# EAGLE design Hindi character1 (EAGLE 7.6.0)
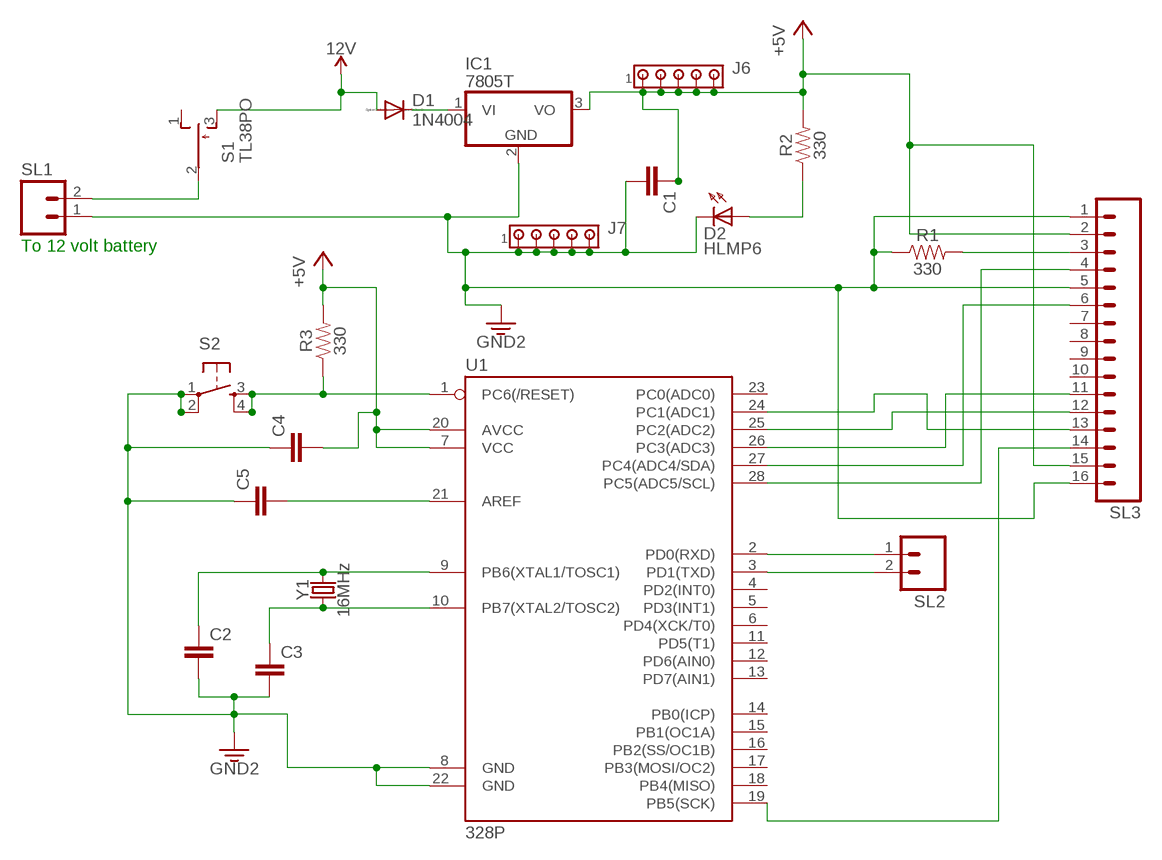
[diagram p0: schematic, sheet 1]

## Parts
C1  C5/2.5  [C5B2.5]
C2  C5/2.5  [C5B2.5]
C3  C5/2.5  [C5B2.5]
C4  C5/2.5  [C5B2.5]
C5  C5/2.5  [C5B2.5]
D1  1N4004  [DO41-10]
D2  HLMP6  [HLMP6]
IC1  7805T  [TO220H]
J6  MTA05-100  [10X05MTA]
J7  MTA05-100  [10X05MTA]
R1  330  330OHM-HORIZ-1/10W-5%  [AXIAL-0.3]
R2  330  330OHM-HORIZ-1/10W-5%  [AXIAL-0.3]
R3  330  330OHM-HORIZ-1/10W-5%  [AXIAL-0.3]
S1  TL38PO  [TL3XPO]
S2  TAC_SWITCHPTH  [TACTILE-PTH]
SL1  MA02  [02PA]
SL2  MA02  [02PA]
SL3  MA16  [16PA]
U1  328P  ATMEGA328P_PDIP  [DIP28]
Y1  16MHz  CRYSTAL-16MHZPTH-HC49US  [HC49US]

## Nets
3.3V: C1.2 C2.2 C3.2 C4.1 C5.1 D2.K IC1.2(GND) J7.1 J7.2 J7.3 J7.4 J7.5 R1.P$1 S2.1 S2.2 SL1.1 SL3.1 SL3.5 SL3.16 U1.8(GND) U1.22(GND) ; supply symbol labelled GND2
12V: D1.A S1.3(S)
+5V: C1.1 C4.2 IC1.3(VO) J6.1 J6.2 J6.3 J6.4 J6.5 R2.P$2 R3.P$2 SL3.2 SL3.15 U1.7(VCC) U1.20(AVCC)
N$1: SL2.1 U1.2(PD0(RXD))
N$2: SL2.2 U1.3(PD1(TXD))
N$3: SL3.4 U1.28(PC5(ADC5/SCL))
N$4: SL3.6 U1.27(PC4(ADC4/SDA))
N$5: R1.P$2 SL3.3
N$6: SL3.11 U1.26(PC3(ADC3))
N$7: D2.A R2.P$1
N$8: C3.1 U1.10(PB7(XTAL2/TOSC2)) Y1.1
N$9: SL3.12 U1.25(PC2(ADC2))
N$10: R3.P$1 S2.3 S2.4 U1.1(PC6(/RESET))
N$11: SL3.13 U1.24(PC1(ADC1))
N$12: C5.2 U1.21(AREF)
N$13: SL3.14 U1.19(PB5(SCK))
N$14: S1.2(P) SL1.2
N$16: D1.C IC1.1(VI)
N$18: C2.1 U1.9(PB6(XTAL1/TOSC1)) Y1.2
Unconnected: S1.1(O) SL3.7 SL3.8 SL3.9 SL3.10 U1.4(PD2(INT0)) U1.5(PD3(INT1)) U1.6(PD4(XCK/T0)) U1.11(PD5(T1)) U1.12(PD6(AIN0)) U1.13(PD7(AIN1)) U1.14(PB0(ICP)) U1.15(PB1(OC1A)) U1.16(PB2(SS/OC1B)) U1.17(PB3(MOSI/OC2)) U1.18(PB4(MISO)) U1.23(PC0(ADC0))

## Notes on the sheet
- To 12 volt battery

## Library data of the parts
C1-C5 = capacitor-wima:C: CAPACITOR naming: grid - package width
D1 = diode:1N4004: DIODE general purpose rectifier, 1 A
D2 = display-hp:HLMP6: LED 2mm horizontal; MF: AGILENT TECHNOLOGIES; MPN: HLMP-6500; OC_FARNELL: 1652490; OC_NEWARK: 40K0088
IC1 = linear:78*: Positive VOLTAGE REGULATOR Source: http://cache.national.com/ds/LM/LM78L05.pdf http://www.fairchildsemi.com/ds/LM/LM7805.pdf
J6 J7 = con-amp:MTA05-100: AMP connector
R1-R3 = SparkFun-Resistors:330OHM: 330Ω resistor A resistor is a passive two-terminal electrical component that implements electrical resistance as a circuit element. Resistors act to reduce current flow, and, at the same time, act to lower voltage levels within circuits. - Wikipedia; PROD_ID: RES-8371
S1 = switch:TL38PO: TINY SWITCH ON OFF MOM Source: http://www2.produktinfo.conrad.com/datenblaetter/700000-724999/705152-da-01-de-Subminiaturschalter_TL_36YO.pdf
S2 = SparkFun-Retired:TAC_SWITCH: Momentary Switch Button commonly used for reset or general input. Spark Fun Electronics SKU : COM-00097 SMT- SWCH-08247
SL1 SL2 = con-amp-quick:MA02: AMP QUICK CONNECTOR; OC_FARNELL: unknown; OC_NEWARK: unknown
SL3 = con-amp-quick:MA16: AMP QUICK CONNECTOR; OC_FARNELL: unknown; OC_NEWARK: unknown
U1 = SparkFun-IC-Microcontroller:ATMEGA328P_PDIP: Atmel 328P Through hole ATMEGA328P uC used in the Arduino 32kb flash, 1k EEPROM, 2k SRAM Datasheet <http://www.sparkfun.com/datasheets/Components/SMD/ATMega328.pdf> SparkFun Products Storefront component: AVR 28 Pin 20MHz 32K 6A/D - ATMega328P <https://www.sparkfun.com/products/9061> (COM-09061) SparkFun Simon Says - Through-Hole Soldering Kit <https://www.sparkfun.com/products/10547> (KIT-10547) SparkFun Learn to Solder - Simon Says <https://www.sparkfun.com/products/13708> (KIT-13708) SparkFun BigTime Watch Kit <https://www.sparkfun.com/products/11734> (KIT-11734) SparkFun ClockIt <https://www.sparkfun.com/products/10930> (KIT-10930) SparkFun Serial Enabled LCD Kit <https://www.sparkfun.com/products/10097> (LCD-10097) SparkFun Simon Tilts - Through Hole Soldering Kit <https://www.sparkfun.com/products/12634> (KIT-12634) SparkFun Frequency Counter Kit <https://www.sparkfun.com/products/10140> (KIT-10140) FabFM Radio Kit <https://www.sparkfun.com/products/11043> (KIT-11043) SparkFun Binary Blaster Kit <https://www.sparkfun.com/products/12037> (KIT-12037) SparkFun Metro-Gnome <https://www.sparkfun.com/products/9236> (KIT-09236) ATmega328 with Arduino Optiboot (Uno) <https://www.sparkfun.com/products/10524> (DEV-10524); PROD_ID: IC-09136
Y1 = SparkFun-Clocks:CRYSTAL-16MHZ: 16MHz Crystal Digikey Example <http://www.digikey.com/product-search/en?keywords=535-9122-1-ND> Frequency: 16MHz Frequency Stability: ±50ppm Frequency Tolerance: ±20ppm Load Capacitance: 18pF SparkFun Products: Pro Micro -5V/16MHz <https://www.sparkfun.com/products/12640> SparkFun Serial Enabled LCD Kit <https://www.sparkfun.com/products/10097>; PROD_ID: XTAL-08181; SF_ID: COM-00536

## Board
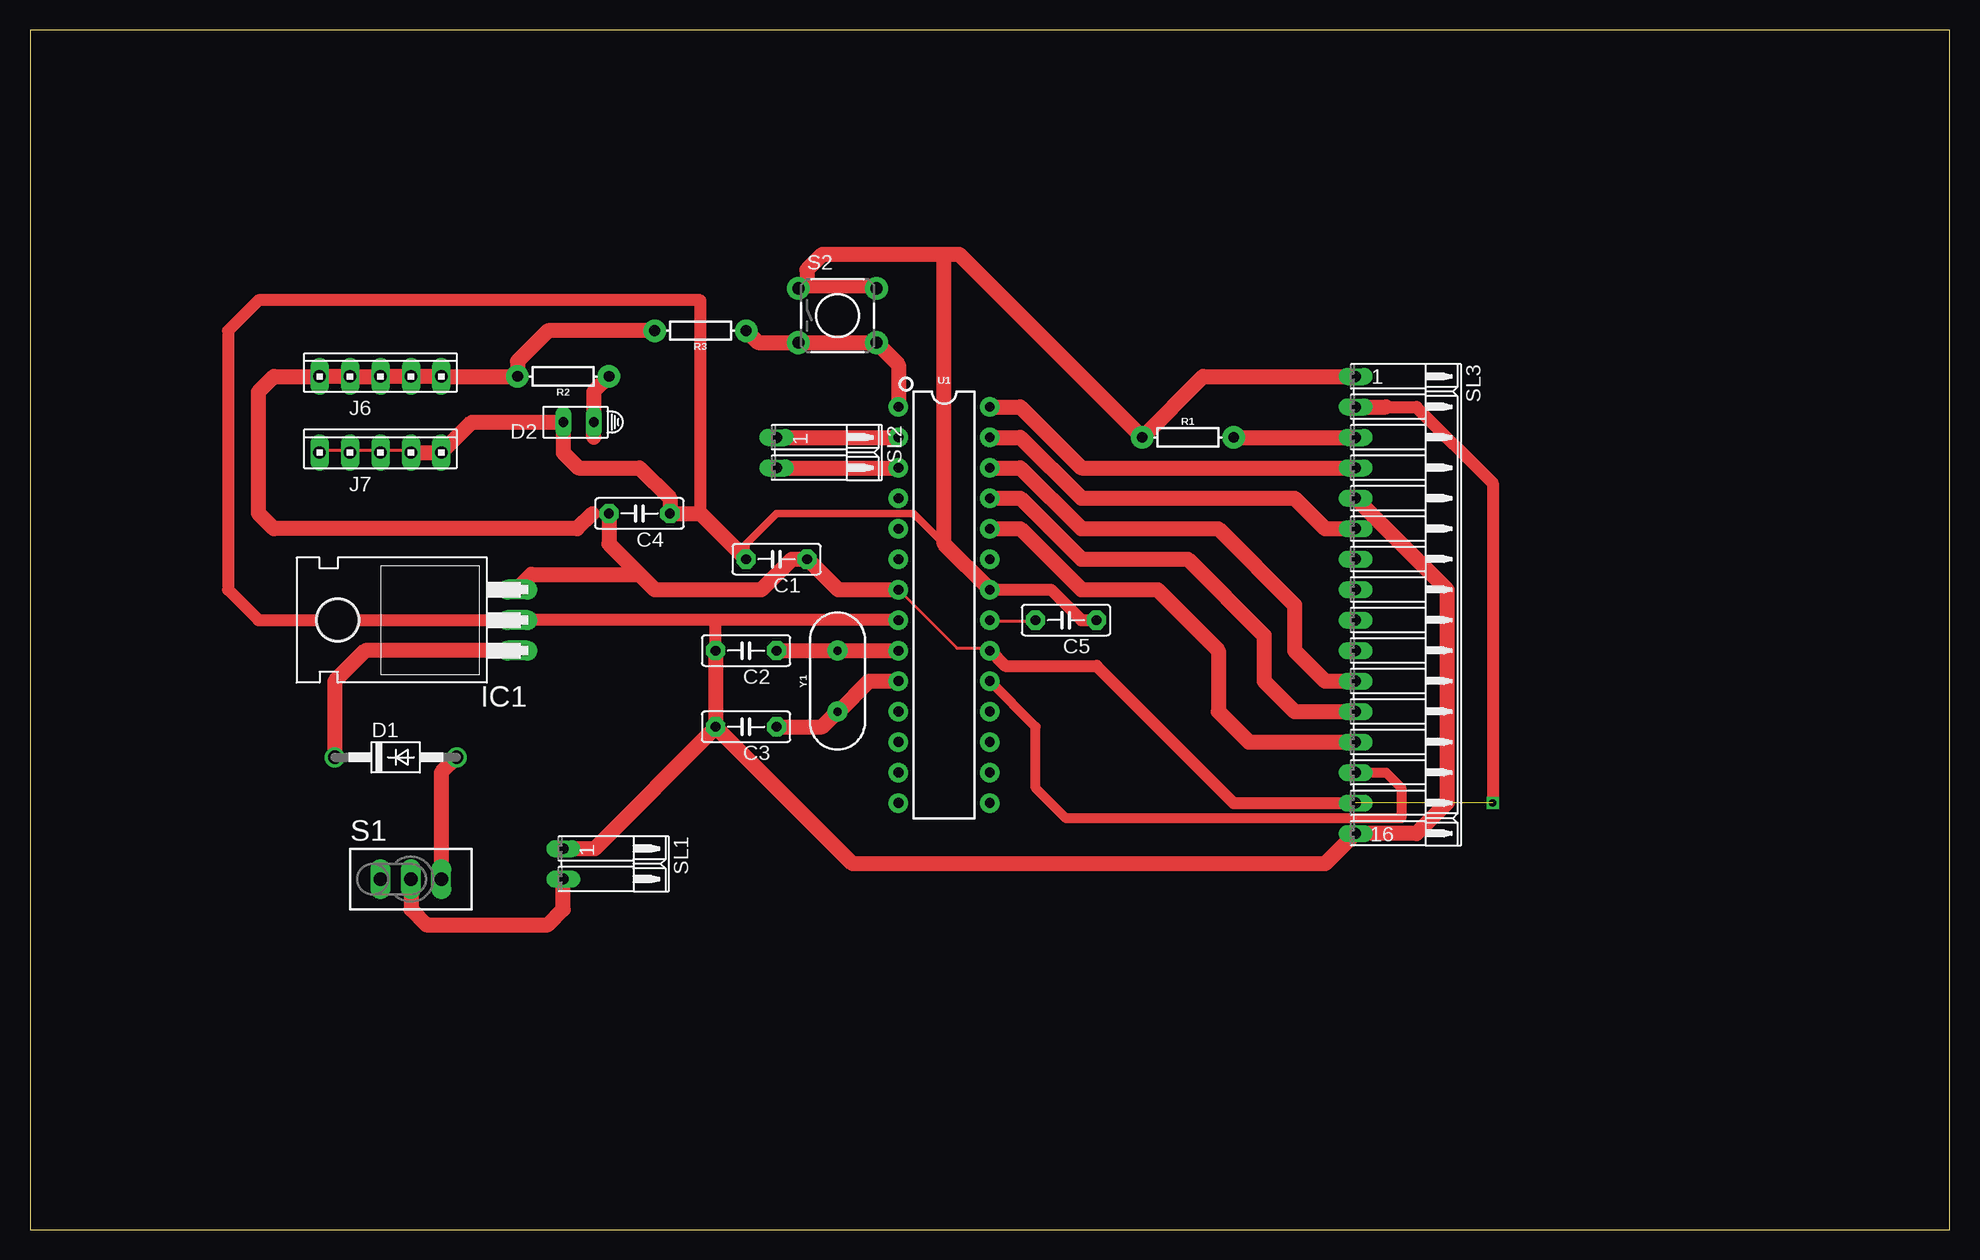
[diagram p1: board, top side]

Size 160 x 100 mm. Coordinates in mm from the lower left corner, seen from the top.
Outline: 0,0 160,0 160,100 0,100 0,0
Copper layers (1*16): Top 0.035mm / dielectric 1.5mm / Bottom 0.035mm
Design rules "default": minimum track width 10mil, minimum drill 24mil, track to track 8mil, track to pad 8mil, pad to pad 8mil, via to via 8mil, smd to smd 8mil, copper to edge 40mil, drill to drill 8mil, minimum pad ring 10mil, minimum via ring 8mil, stop-mask expansion 4mil, vias tented up to drill 0mil, thermal gap 10mil

### Footprints (pad centres in the part's own frame; a part is rotated, then mirrored left to right if it is on the bottom)
C5B2.5 = drill 0.813 pad 1.6 octagon: 1 -2.54,0; 2 2.54,0
DO41-10 = drill 1.118: A 5.08,0; C -5.08,0
HLMP6 = drill 0.813 long: A -1.27,0; K 1.27,0
TO220H = drill 1.118 long: 1 -2.54,-10.16; 2 0,-10.16; 3 2.54,-10.16 | hole 3.302: 0,4.826
10X05MTA = drill 1.016 long: 1 5.08,0; 2 2.54,0; 3 0,0; 4 -2.54,0; 5 -5.08,0
AXIAL-0.3 = drill 0.9 pad 1.88: P$1 -3.81,0; P$2 3.81,0
TL3XPO = drill 1.1 pad 1.422 long: 1 -2.54,0; 2 0,0; 3 2.54,0
TACTILE-PTH = drill 1.016 pad 1.88: 1 -3.251,2.261; 2 3.251,2.261; 3 -3.251,-2.261; 4 3.251,-2.261
02PA = drill 0.914 long: 1 -1.27,0; 2 1.27,0
16PA = drill 0.914 long: 1 -19.05,0; 2 -16.51,0; 3 -13.97,0; 4 -11.43,0; 5 -8.89,0; 6 -6.35,0; 7 -3.81,0; 8 -1.27,0; 9 1.27,0; 10 3.81,0; 11 6.35,0; 12 8.89,0; 13 11.43,0; 14 13.97,0; 15 16.51,0; 16 19.05,0
DIP28 = drill 0.813 pad 1.626: 1 -16.51,-3.81; 2 -13.97,-3.81; 3 -11.43,-3.81; 4 -8.89,-3.81; 5 -6.35,-3.81; 6 -3.81,-3.81; 7 -1.27,-3.81; 8 1.27,-3.81; 9 3.81,-3.81; 10 6.35,-3.81; 11 8.89,-3.81; 12 11.43,-3.81; 13 13.97,-3.81; 14 16.51,-3.81; 15 16.51,3.81; 16 13.97,3.81; 17 11.43,3.81; 18 8.89,3.81; 19 6.35,3.81; 20 3.81,3.81; 21 1.27,3.81; 22 -1.27,3.81; 23 -3.81,3.81; 24 -6.35,3.81; 25 -8.89,3.81; 26 -11.43,3.81; 27 -13.97,3.81; 28 -16.51,3.81
HC49US = drill 0.7 pad 1.651: 1 -2.54,0; 2 2.54,0

### Placement (x,y rotation side)
C1  62.23,55.88 180 top
C2  59.69,48.26 180 top
C3  59.69,41.91 180 top
C4  50.8,59.69 180 top
C5  86.36,50.8 180 top
D1  30.48,39.37 0 top
D2  45.72,67.31 180 top
IC1  30.48,50.8 90 top
J6  29.21,71.12 0 top
J7  29.21,64.77 0 top
R1  96.52,66.04 0 top
R2  44.45,71.12 180 top
R3  55.88,74.93 180 top
S1  31.75,29.21 0 top
S2  67.31,76.2 0 top
SL1  44.45,30.48 270 top
SL2  62.23,64.77 270 top
SL3  110.49,52.07 270 top
U1  76.2,52.07 270 top
Y1  67.31,45.72 90 top

### Tracks (layer width: path | path; a pad name or v marks a point on that pad's centre or on a via)
3.3V
  Top 0.254: J7.2 31.55,64.92 29.26,64.92 J7.3 29.03,64.92 26.75,64.92 J7.4 26.52,64.92 24.23,64.92 J7.5 24,64.92 | 47.09,31.77 44.58,31.77 SL1.1 | 57.15,41.83 C3.2 | 40.69,50.75 IC1.2 | 64.77,78.64 64.24,78.64 S2.1 | 70.41,78.64 S2.2 | 59.66,56.01 C1.2 | 53.49,59.66 C4.1
  Top 0.61: 76.2,57.15 73.66,59.69 62.23,59.69 59.69,57.15 C1.2
  Top 1.016: U1.22 85.09,53.34 87.63,50.8 C5.1 | U1.8 57.15,50.8 | 57.15,50.8 IC1.2 19.05,50.8 16.51,53.34 16.51,74.93 19.05,77.47 55.88,77.47 55.88,59.69 | C2.2 57.15,50.8
  Top 1.27: 76.2,81.28 77.47,81.28 R1.P$1 97.79,71.12 SL3.1 | 76.2,81.28 66.04,81.28 64.77,80.01 64.77,78.64 70.41,78.64 | U1.22 76.2,57.15 76.2,81.28 | SL3.5 118.11,53.34 118.11,35.56 115.57,33.02 SL3.16 107.95,30.48 68.58,30.48 C3.2 C2.2 | 53.49,59.66 53.52,59.69 55.88,59.69 C1.2 | J7.2 J7.1 36.83,67.31 D2.K 44.45,64.77 45.72,63.5 50.8,63.5 53.34,60.96 C4.1 | 57.15,41.83 47.07,31.75 SL1.1
12V
  Top 1.27: D1.A 34.29,38.1 S1.3
+5V  (via drill 0.6)  (1 unrouted)
  Top 0.254: 64.92,55.78 C1.1 64.69,55.78 | U1.7 77.27,48.46 80.01,48.46 U1.20 | 46.86,59.66 48.23,59.66 C4.2 | 40.69,53.49 IC1.3 | 24.23,71.09 J6.5 | 26.52,71.09 J6.4 26.75,71.09 | 29.26,71.09 J6.3 29.03,71.09 | 31.55,71.09 J6.2 31.77,71.09 | 40.46,71.09 R2.P$2 | 34.29,71.09 J6.1 | 51.89,74.75 R3.P$2 | 40.69,71.32 R2.P$2 | 40.69,71.09 R2.P$2
  Top 1.016: U1.20 81.28,46.99 88.9,46.99 100.33,35.56 SL3.15 | SL3.2 115.57,68.58 121.92,62.23 v121.92,35.56
  Top 1.27: SL3.2 113.03,68.58 | 51.89,74.75 51.71,74.93 43.18,74.93 40.64,72.39 R2.P$2 J6.1 J6.2 | 64.92,55.78 67.36,53.34 U1.7 | 39.37,53.34 IC1.3 | C4.2 48.26,57.15 50.8,54.61 | 50.8,54.61 52.07,53.34 60.96,53.34 63.5,55.88 C1.1 | 40.69,53.49 41.81,54.61 50.8,54.61 | 26.52,71.09 26.49,71.12 J6.5 20.32,71.12 19.05,69.85 19.05,59.69 20.32,58.42 45.62,58.42 46.86,59.66 | 26.75,71.09 26.77,71.12 J6.3 31.52,71.12 31.55,71.09
N$1
  Top 1.27: SL2.1 U1.2
N$2
  Top 1.27: SL2.2 U1.3
N$3
  Top 1.27: U1.28 82.55,68.58 87.63,63.5 SL3.4
N$4
  Top 1.27: U1.27 82.55,66.04 87.63,60.96 105.41,60.96 107.95,58.42 SL3.6
N$5
  Top 1.27: R1.P$2 SL3.3
N$6
  Top 1.27: U1.26 82.55,63.5 87.63,58.42 99.06,58.42 105.41,52.07 105.41,48.26 107.95,45.72 SL3.11
N$7
  Top 0.254: 47.09,67.44 D2.A
  Top 1.27: R2.P$1 46.99,69.85 D2.A 46.99,66.04
N$8
  Top 0.254: 62.41,42.06 C3.1 | 67.21,42.98 Y1.1 67.44,43.2
  Top 1.27: 62.41,42.06 62.56,41.91 66.04,41.91 Y1.1 | 67.44,43.2 69.95,45.72 U1.10
N$9
  Top 1.27: U1.25 82.55,60.96 87.63,55.88 96.52,55.88 102.87,49.53 102.87,45.72 105.41,43.18 SL3.12
N$10
  Top 0.254: 72.24,68.58 U1.1 | 70.64,73.84 S2.4 70.41,74.07 | 64.24,74.07 S2.3
  Top 1.27: 64.24,74.07 64.36,73.94 S2.4 | 70.64,73.84 72.39,72.08 U1.1 | R3.P$1 60.68,73.94 S2.3
N$11
  Top 1.27: U1.24 82.55,58.42 87.63,53.34 93.98,53.34 99.06,48.26 99.06,43.18 101.6,40.64 SL3.13
N$12
  Top 0.254: C5.2 83.67,50.75 80.01,50.75 U1.21
N$13
  Top 0.813: SL3.14 113.03,38.1 114.3,36.83 114.3,34.29 86.36,34.29 83.82,36.83 83.82,41.91 U1.19
N$14
  Top 1.27: S1.2 31.75,26.67 33.02,25.4 43.18,25.4 44.45,26.67 SL1.2
N$16
  Top 1.27: IC1.1 27.94,48.26 25.4,45.72 D1.C
N$18
  Top 0.254: 72.24,48.23 U1.9 | 67.44,48.23 Y1.2 67.21,48.23 | 62.41,48.23 C2.1
  Top 1.27: 62.41,48.23 62.43,48.26 Y1.2 | 67.44,48.23 67.46,48.26 U1.9